# EAGLE design ledline (EAGLE 7.7.0)
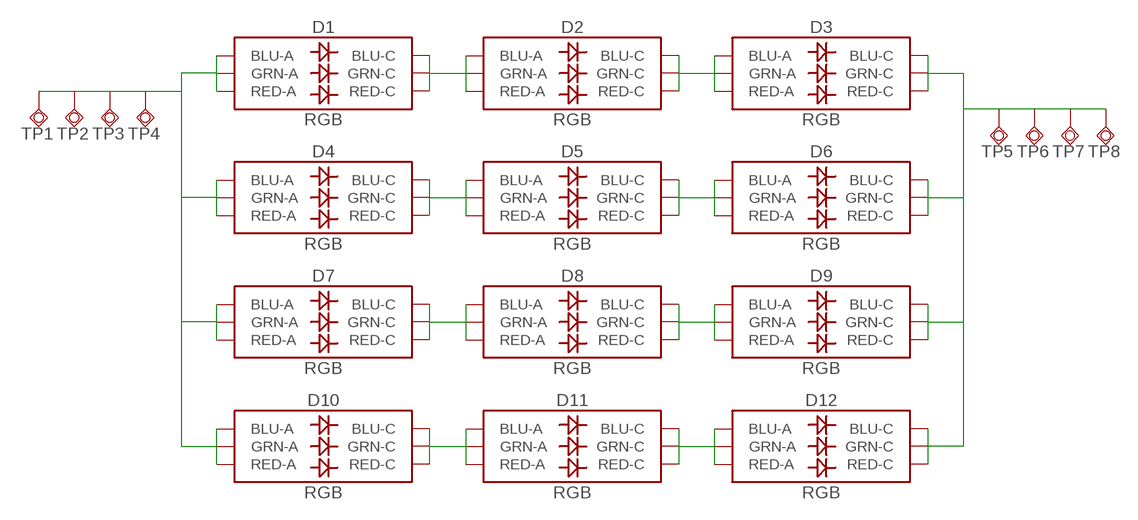
[diagram p0: schematic, sheet 1]

## Parts
D1  RGB  LED-RGBPLCC-6  [PLCC-6-LED]
D2  RGB  LED-RGBPLCC-6  [PLCC-6-LED]
D3  RGB  LED-RGBPLCC-6  [PLCC-6-LED]
D4  RGB  LED-RGBPLCC-6  [PLCC-6-LED]
D5  RGB  LED-RGBPLCC-6  [PLCC-6-LED]
D6  RGB  LED-RGBPLCC-6  [PLCC-6-LED]
D7  RGB  LED-RGBPLCC-6  [PLCC-6-LED]
D8  RGB  LED-RGBPLCC-6  [PLCC-6-LED]
D9  RGB  LED-RGBPLCC-6  [PLCC-6-LED]
D10  RGB  LED-RGBPLCC-6  [PLCC-6-LED]
D11  RGB  LED-RGBPLCC-6  [PLCC-6-LED]
D12  RGB  LED-RGBPLCC-6  [PLCC-6-LED]
TP1  TPSQTP10SQ  [TP10SQ]
TP2  TPSQTP10SQ  [TP10SQ]
TP3  TPSQTP10SQ  [TP10SQ]
TP4  TPSQTP10SQ  [TP10SQ]
TP5  TPSQTP10SQ  [TP10SQ]
TP6  TPSQTP10SQ  [TP10SQ]
TP7  TPSQTP10SQ  [TP10SQ]
TP8  TPSQTP10SQ  [TP10SQ]

## Nets
GND: D3.CB(BLU-C) D3.CG(GRN-C) D3.CR(RED-C) D6.CB(BLU-C) D6.CG(GRN-C) D6.CR(RED-C) D9.CB(BLU-C) D9.CG(GRN-C) D9.CR(RED-C) D12.CB(BLU-C) D12.CG(GRN-C) D12.CR(RED-C) TP5.TP TP6.TP TP7.TP TP8.TP
N$2: D1.CB(BLU-C) D1.CG(GRN-C) D1.CR(RED-C) D2.AB(BLU-A) D2.AG(GRN-A) D2.AR(RED-A)
N$4: D2.CB(BLU-C) D2.CG(GRN-C) D2.CR(RED-C) D3.AB(BLU-A) D3.AG(GRN-A) D3.AR(RED-A)
N$8: D4.CB(BLU-C) D4.CG(GRN-C) D4.CR(RED-C) D5.AB(BLU-A) D5.AG(GRN-A) D5.AR(RED-A)
N$9: D5.CB(BLU-C) D5.CG(GRN-C) D5.CR(RED-C) D6.AB(BLU-A) D6.AG(GRN-A) D6.AR(RED-A)
N$12: D7.CB(BLU-C) D7.CG(GRN-C) D7.CR(RED-C) D8.AB(BLU-A) D8.AG(GRN-A) D8.AR(RED-A)
N$13: D8.CB(BLU-C) D8.CG(GRN-C) D8.CR(RED-C) D9.AB(BLU-A) D9.AG(GRN-A) D9.AR(RED-A)
N$16: D10.CB(BLU-C) D10.CG(GRN-C) D10.CR(RED-C) D11.AB(BLU-A) D11.AG(GRN-A) D11.AR(RED-A)
N$17: D11.CB(BLU-C) D11.CG(GRN-C) D11.CR(RED-C) D12.AB(BLU-A) D12.AG(GRN-A) D12.AR(RED-A)
VCC: D1.AB(BLU-A) D1.AG(GRN-A) D1.AR(RED-A) D4.AB(BLU-A) D4.AG(GRN-A) D4.AR(RED-A) D7.AB(BLU-A) D7.AG(GRN-A) D7.AR(RED-A) D10.AB(BLU-A) D10.AG(GRN-A) D10.AR(RED-A) TP1.TP TP2.TP TP3.TP TP4.TP

## Library data of the parts
D1-D12 = SparkFun-LED:LED-RGB: LED-RGB 6 pin RGB LED (no common connector) Packages: PLCC-6 LED-TRICOLOR-5050 - No built-in IC SparkFun Products: Digital Sandbox <https://www.sparkfun.com/products/12651> LED- SMD RGB <https://www.sparkfun.com/products/10866>; PROD_ID: DIO-12113
TP1-TP8 = testpad:TPSQ: Test pad

## Board
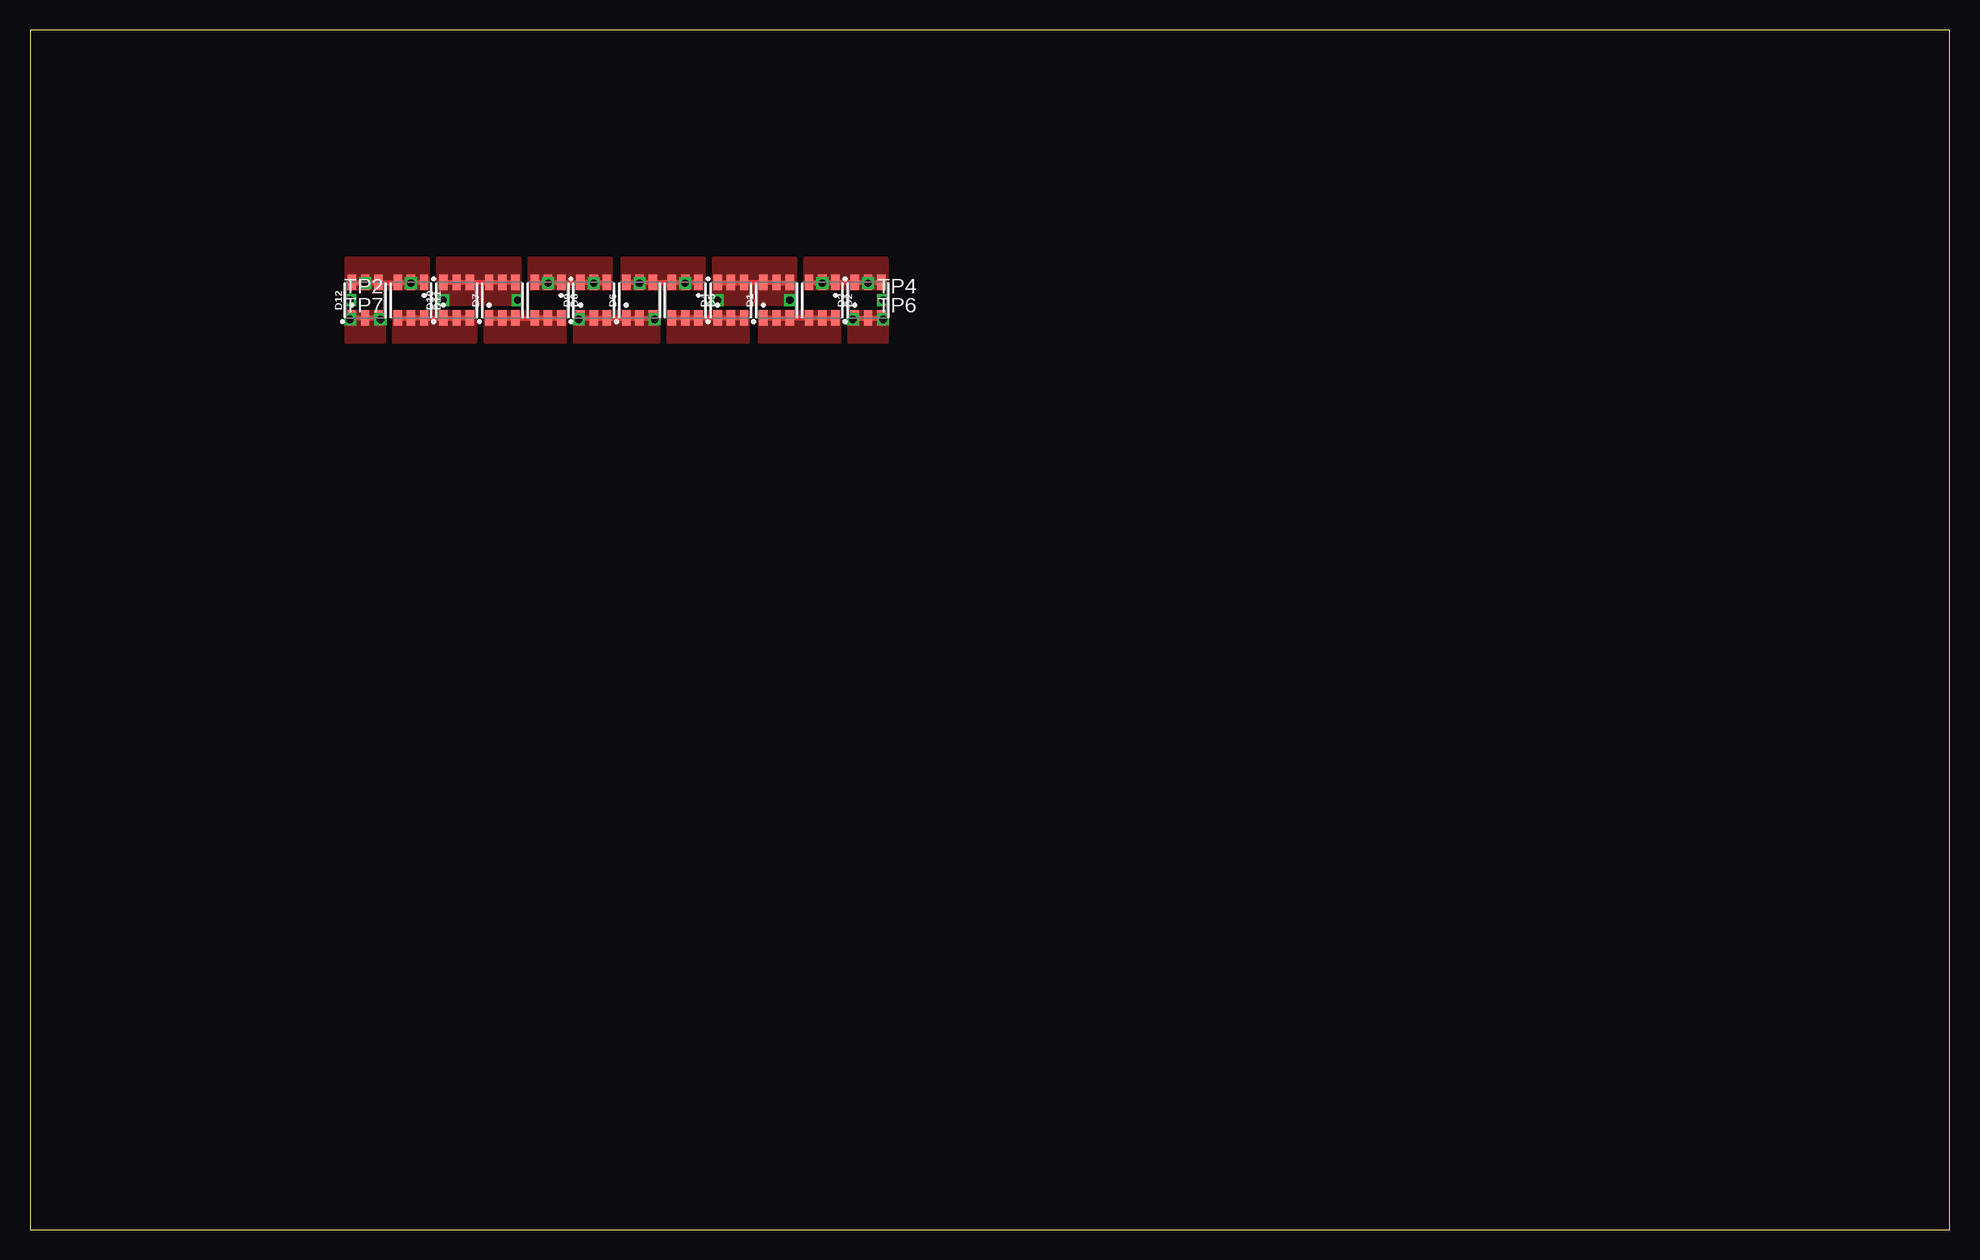
[diagram p1: board, top side]
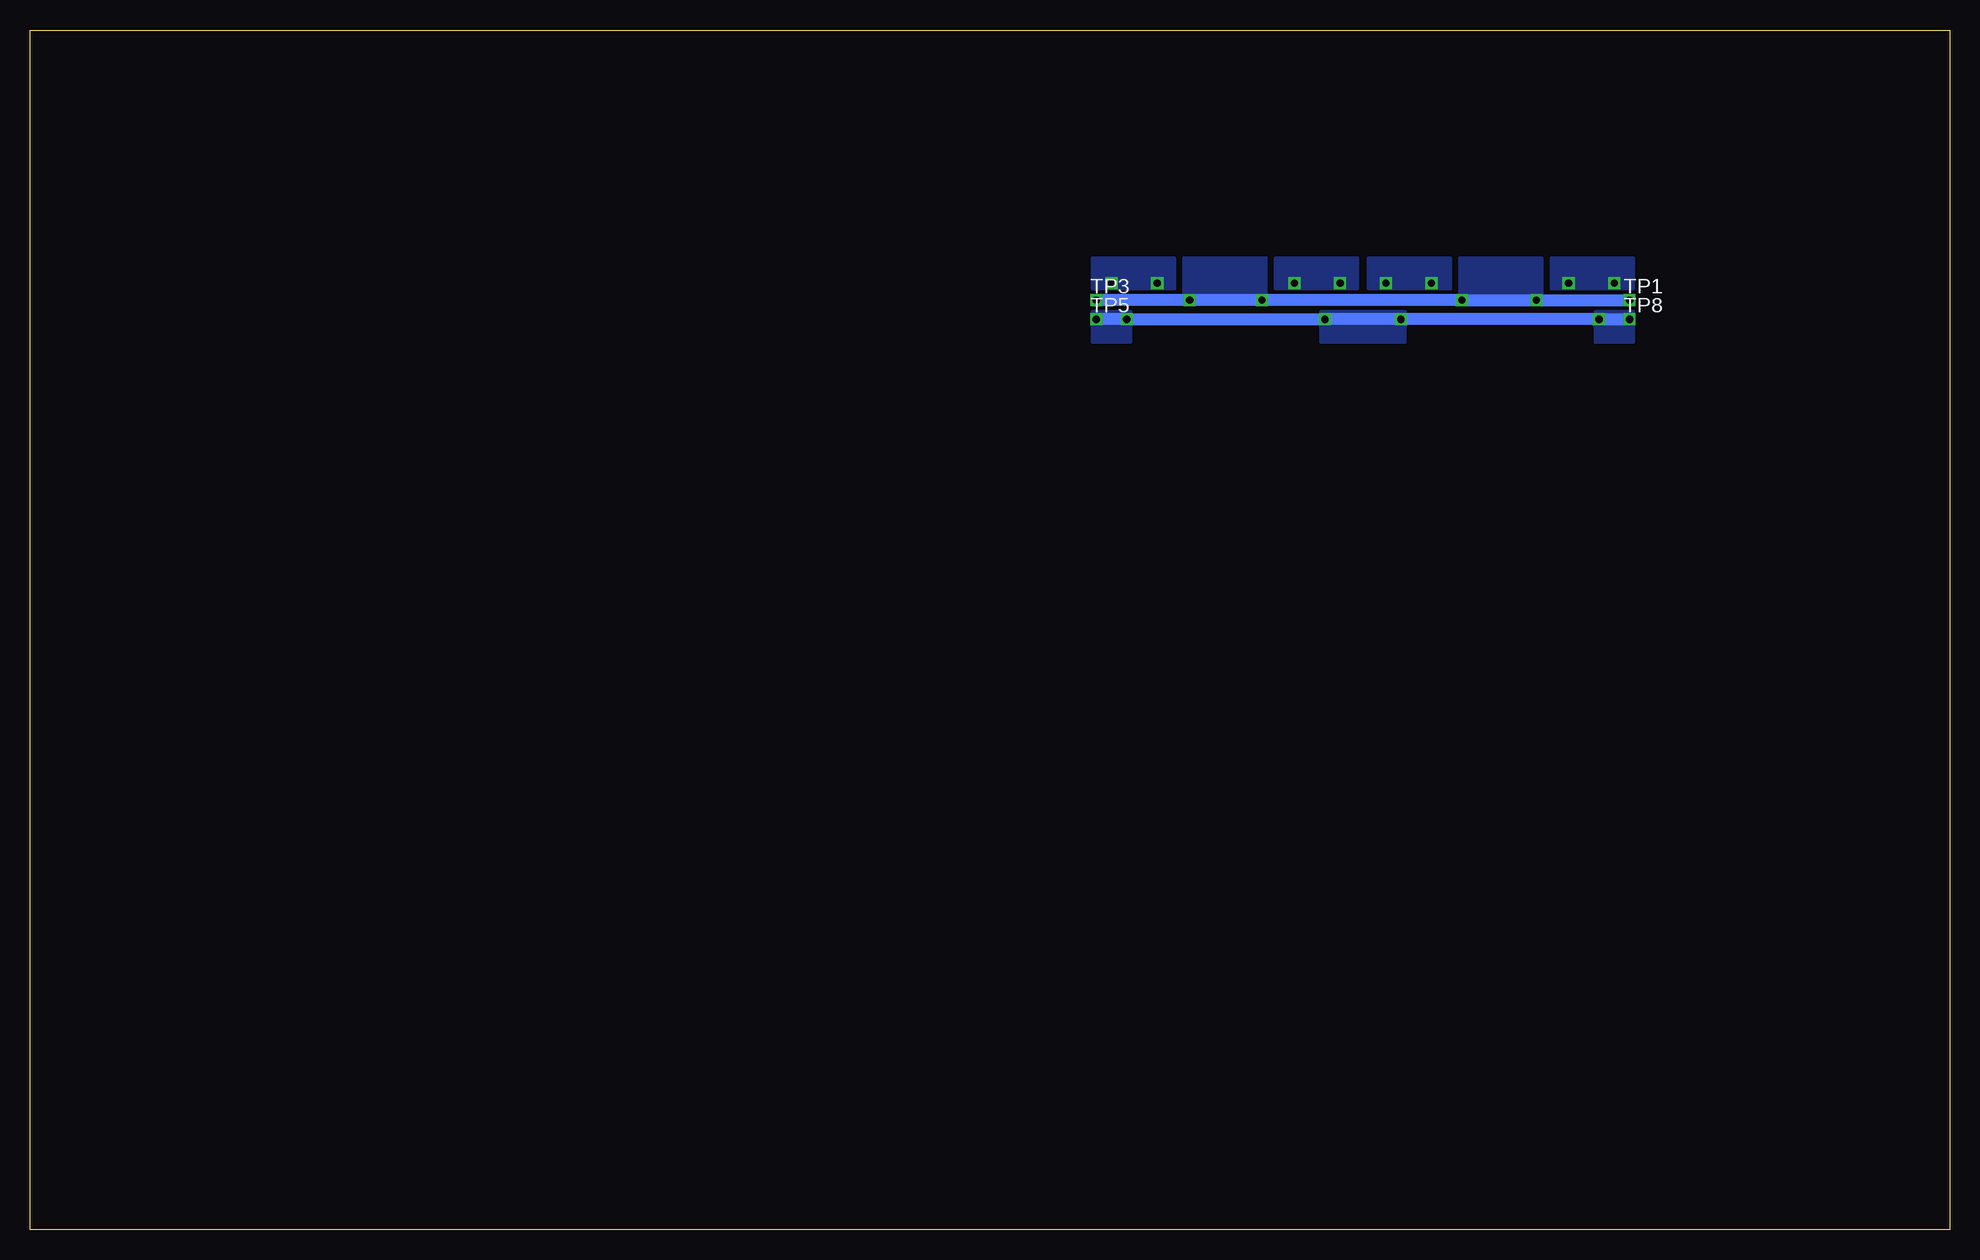
[diagram p2: board, bottom side, seen from below]

Size 160 x 100 mm. Coordinates in mm from the lower left corner, seen from the top.
Outline: 0,0 160,0 160,100 0,100 0,0
Copper layers (1*16): Top 0.035mm / dielectric 1.5mm / Bottom 0.035mm
Design rules "default": minimum track width 10mil, minimum drill 24mil, track to track 8mil, track to pad 8mil, pad to pad 8mil, via to via 8mil, smd to smd 8mil, copper to edge 40mil, drill to drill 8mil, minimum pad ring 10mil, minimum via ring 8mil, stop-mask expansion 4mil, vias tented up to drill 0mil, thermal gap 10mil

### Footprints (pad centres in the part's own frame; a part is rotated, then mirrored left to right if it is on the bottom)
PLCC-6-LED = smd 1.3 x 0.7: AB 1.475,1.1; AG 1.475,-1.1; AR 1.475,0; CB -1.475,1.1; CG -1.475,-1.1; CR -1.475,0
TP10SQ = smd 1 x 1: TP 0,0

### Placement (x,y rotation side)
D1  62.23,77.47 90 top
D2  66.04,77.47 270 top
D3  69.85,77.47 90 top
D4  58.42,77.47 90 top
D5  54.61,77.47 270 top
D6  50.8,77.47 90 top
D7  39.37,77.47 90 top
D8  43.18,77.47 270 top
D9  46.99,77.47 90 top
D10  35.56,77.47 90 top
D11  31.75,77.47 270 top
D12  27.94,77.47 90 top
TP1  26.67,77.47 0 bottom
TP2  26.67,77.47 0 top
TP3  71.12,77.47 0 bottom
TP4  71.12,77.47 0 top
TP5  71.12,75.88 0 bottom
TP6  71.12,75.88 0 top
TP7  26.67,75.88 0 top
TP8  26.67,75.88 0 bottom

### Tracks (layer width: path | path; a pad name or v marks a point on that pad's centre or on a via)
GND  (via drill 0.6)
  Top 0.406: D12.CB D12.CR D12.CG 29.21,76 v29.21,75.88 | D9.CB D9.CR | D9.CR 45.72,76 v45.72,75.88 | D9.CR D9.CG D6.CB D6.CR D6.CG 51.9,76.2 v52.07,75.88 | D3.CG D3.CR D3.CB 68.58,76 v68.58,75.88
  Bottom 0.406: D9.CB 45.89,76.2 v45.72,75.88
  Bottom 1.016: TP5.TP v68.58,75.88 v52.07,75.88 v45.72,75.88 v29.21,75.88 TP7.TP
  other vias: 71.12,75.88 26.67,75.88
  pour Top (no thermals): 26.35,73.98 26.35,76.52 29.53,76.52 29.53,73.98
  pour Top (no thermals): 45.4,73.98 45.4,76.52 52.39,76.52 52.39,74.14 52.39,73.98
  pour Top (no thermals): 68.26,73.98 68.26,76.52 71.44,76.52 71.44,73.98
  pour Bottom (no thermals): 26.35,76.52 26.35,73.98 29.53,73.98 29.53,76.52
  pour Bottom (no thermals): 68.26,76.52 68.26,73.98 71.44,73.98 71.44,76.52
  pour Bottom (no thermals): 45.4,76.52 45.4,73.98 52.39,73.98 52.39,76.52
N$2
  Top 0.406: D2.AB D2.AR D2.AG D1.CG D1.CR D1.CB 60.96,76 60.96,76.2
  pour Top (no thermals): 60.8,73.98 60.8,76.52 67.47,76.52 67.47,73.98
N$4  (via drill 0.6)
  Top 0.406: D3.AG D3.AR D3.AB D2.CB D2.CR D2.CG
  other vias: 66.04,78.9 69.85,78.9
  pour Top (no thermals): 64.61,78.42 64.61,80.96 71.44,80.96 71.44,78.42
  pour Bottom (no thermals): 64.61,80.96 64.61,78.42 71.44,78.42 71.44,80.96
N$8
  Top 0.406: D4.CG D4.CR D4.CB D5.AB D5.AR D5.AG 53.34,76 53.34,76.2
  pour Top (no thermals): 53.18,76.52 53.18,73.98 59.85,73.98 59.85,76.52
N$9  (via drill 0.6)
  Top 0.406: D5.CB D5.CR D5.CG D6.AG D6.AR D6.AB 49.53,78.94 49.53,78.74
  other vias: 50.8,78.9 54.61,78.9
  pour Top (no thermals): 49.37,78.42 49.37,80.96 56.2,80.96 56.2,78.42
  pour Bottom (no thermals): 49.37,80.96 56.2,80.96 56.2,78.42 49.37,78.42
N$12
  Top 0.406: D7.CB D7.CR D7.CG D8.AG D8.AR D8.AB
  pour Top (no thermals): 37.94,76.52 37.94,73.98 44.61,73.98 44.61,76.52
N$13  (via drill 0.6)
  Top 0.406: D8.CG D8.CR D8.CB D9.AB D9.AR D9.AG
  other vias: 43.18,78.9 46.99,78.9
  pour Top (no thermals): 41.59,78.42 41.59,80.96 48.42,80.96 48.42,78.42
  pour Bottom (no thermals): 41.59,80.96 41.59,78.42 48.42,78.42 48.42,80.96
N$16
  Top 0.406: D10.CG D10.CR D10.CB D11.AB D11.AR | D11.AG D11.AR | D11.AR 31.75,76.2
  pour Top (no thermals): 30.32,73.98 30.32,76.52 37.15,76.52 37.15,73.98
N$17  (via drill 0.6)
  Top 0.406: D12.AB D12.AR D12.AG D11.CG D11.CR | D11.CB D11.CR | D11.CR v31.75,78.9 31.75,78.74
  other vias: 27.94,78.9
  pour Top (no thermals): 26.35,78.42 26.35,80.96 33.18,80.96 33.18,78.42
  pour Bottom (no thermals): 26.35,80.96 33.18,80.96 33.18,78.42 26.35,78.42
VCC  (via drill 0.6)
  Top 0.406: D10.AB D10.AR D10.AG D7.AB D7.AR D7.AG 40.64,78.94 | 57.32,78.74 D4.AB D4.AR D4.AG D1.AB D1.AR D1.AG
  Bottom 1.016: TP1.TP v40.64,77.47 v57.31,77.47 TP4.TP
  other vias: 71.12,77.47 26.67,77.47 34.45,77.47 63.34,77.47
  pour Top (no thermals): 56.99,77.15 56.99,80.96 63.82,80.96 63.82,77.15
  pour Top (no thermals): 33.97,77.15 33.97,80.96 40.8,80.96 40.8,77.15
  pour Bottom (no thermals): 56.99,80.96 56.99,77.15 63.82,77.15 63.82,80.96
  pour Bottom (no thermals): 33.97,80.96 33.97,77.15 40.8,77.15 40.8,80.96